# Altium schematic sheet smarttrashcan.SchDoc
size A; SheetNumber: 3; SheetTotal: 3
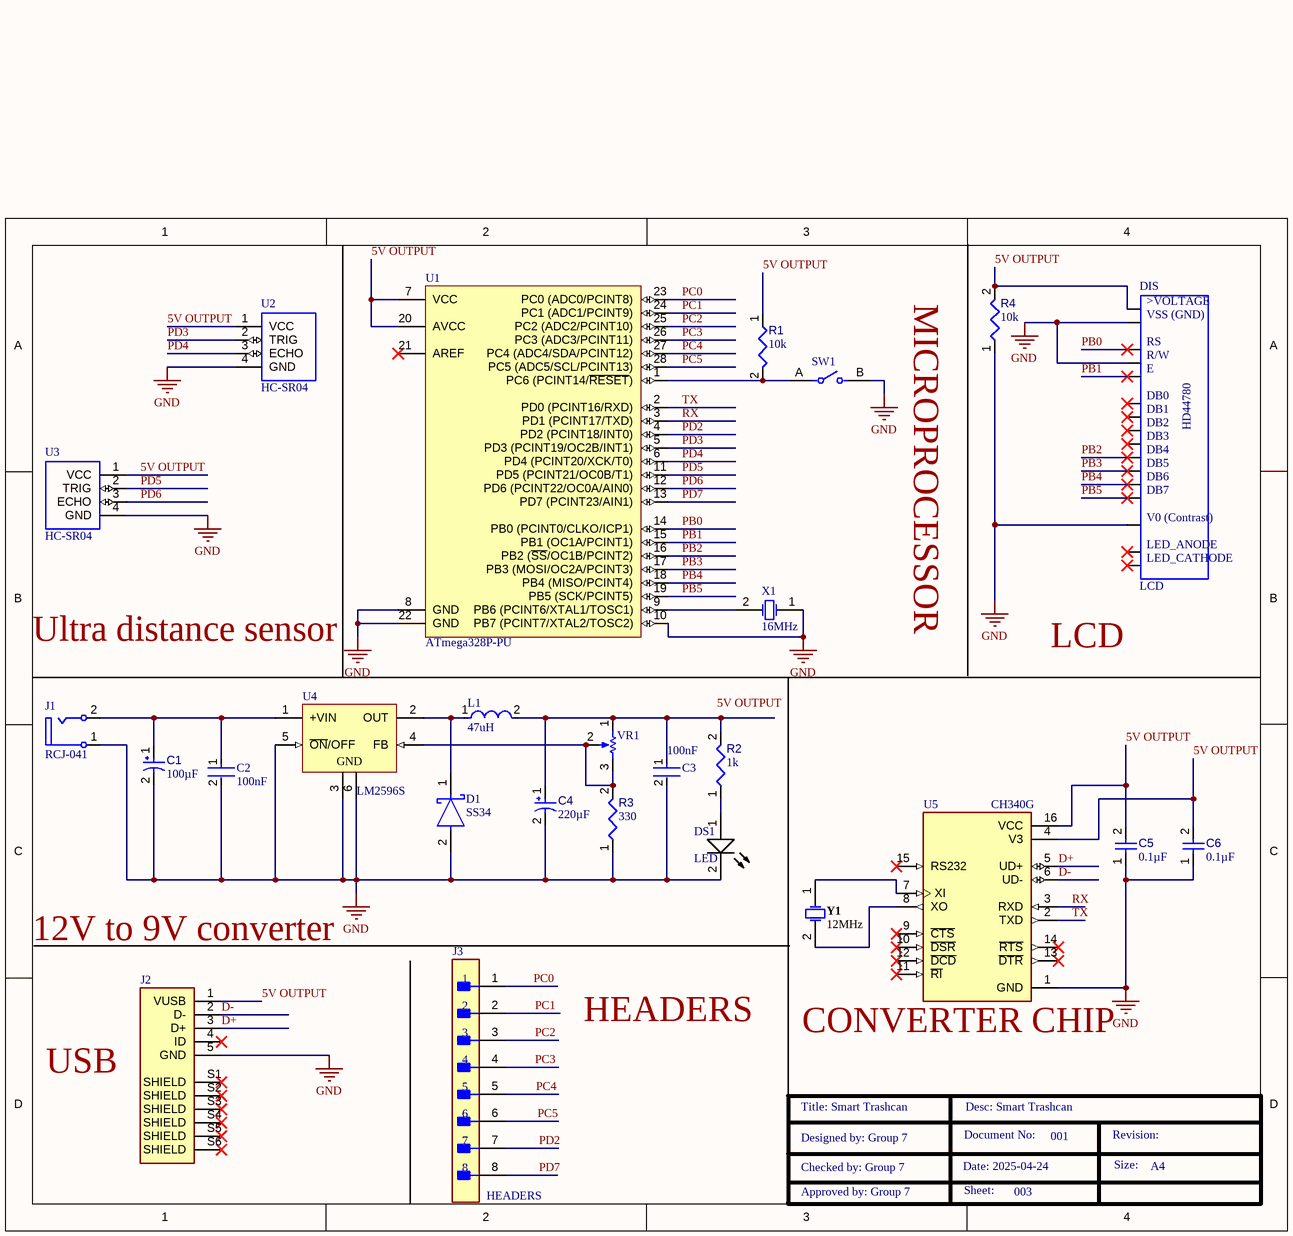
[diagram p0: smarttrashcan.SchDoc]

## Parts
C1  value 100µF  [CAPPR65-500-1600X1000X1700]  (hidden comment: ECA-2AM101)
C2  100nF  [FP-1812-L_4_5_0_3-W_3_2_0-IPC_C]
C3  100nF  [FP-1812-L_4_5_0_3-W_3_2_0-IPC_C]
C4  value 220µF  [CAPMP7344X31-T_V]  (hidden comment: TPSD227K010R0150)
C5  value 0.1µF  [CAPC1005X56X25LL10T15]  (hidden comment: Capacitor 0.1 uF +/- 5% 16 V 0402)
C6  value 0.1µF  [CAPC1005X56X25LL10T15]  (hidden comment: Capacitor 0.1 uF +/- 5% 16 V 0402)
D1  SS34  [FP-95402-MFG]
DIS  LCD  [16026-16X2]
DS1  LED  [EVRL-0402-2_V]
J1  RCJ-041  [CUI-RCJ-041_V]
J2  10118193-0001LF  [AMPHENOL_10118193-0001LF]  (value not drawn)
J3  HEADERS  [FP-22-11-2082-MFG]
L1  47uH  [FP-LB3225-2_5-0_2-IPC_B]
R1  value 10k  [RESC0402(1005)_L]  (hidden comment: 10KR2F)
R2  value 1k  [RESC0402(1005)_L]  (hidden comment: Resistor 330R +/-5 % 0402 63 mW)
R3  value 330  [RESC0402(1005)_L]  (hidden comment: Resistor 330R +/-5 % 0402 63 mW)
R4  value 10k  [RESC0402(1005)_L]  (hidden comment: 10KR2F)
SW1  EVQ11Y04K  [FP-EVQ11Y04K-MFG]  (value not drawn)
U1  ATmega328P-PU  [28P3]
U2  HC-SR04  [XCVR_HC-SR04]
U3  HC-SR04  [XCVR_HC-SR04]
U4  LM2596S  [KTT0005B_L]
U5  CH340G  [SOIC127P600X180-16N]
VR1  3296W-1-103LF  [BOUR-3296W]  (value not drawn)
X1  16MHz  [FOX-FOXSDLF160-20_V]
Y1  12MHz  [FOX-FOXSLF-2_V]

## Nets
GND: C1.2 C2.2 C3.2 C4.2 C5.1 C6.1 D1.2(A) DIS.P$1(VSS) DIS.P$3(CONTRAST) DIS.P$5(R/W) DS1.2(K) J1.1 J2.5(GND) R3.1 R4.1 SW1.B U1.8(GND) U1.10(PB7_(PCINT7/XTAL2/TOSC2)) U1.22(GND) U2.4(GND) U3.4(GND) U4.3(GND) U4.5(~{ON}/OFF) U4.6(GND) U5.1(GND) X1.1(X1)
5V OUTPUT: C5.2 C6.2 DIS.P$2(VDD) J2.1(VUSB) R1.1 R4.2 U1.7(VCC) U1.20(AVCC) U2.1(VCC) U3.1(VCC) U5.4(V3) U5.16(VCC)
D+: J2.3(D+) U5.5(UD+)
D-: J2.2(D-) U5.6(UD-)
PB0: DIS.P$4(RS) U1.14(PB0_(PCINT0/CLKO/ICP1))
PB1: DIS.P$6(E) U1.15(PB1_(OC1A/PCINT1))
PB2: DIS.P$11(DB4) U1.16(PB2_(~{SS}/OC1B/PCINT2))
PB3: DIS.P$12(DB5) U1.17(PB3_(MOSI/OC2A/PCINT3))
PB4: DIS.P$13(DB6) U1.18(PB4_(MISO/PCINT4))
PB5: DIS.P$14(DB7) U1.19(PB5_(SCK/PCINT5))
PC0: J3.1 U1.23(PC0_(ADC0/PCINT8))
PC1: J3.2 U1.24(PC1_(ADC1/PCINT9))
PC2: J3.3 U1.25(PC2_(ADC2/PCINT10))
PC3: J3.4 U1.26(PC3_(ADC3/PCINT11))
PC4: J3.5 U1.27(PC4_(ADC4/SDA/PCINT12))
PC5: J3.6 U1.28(PC5_(ADC5/SCL/PCINT13))
PD2: J3.7 U1.4(PD2_(PCINT18/INT0))
PD3: U1.5(PD3_(PCINT19/OC2B/INT1)) U2.2(TRIG)
PD4: U1.6(PD4_(PCINT20/XCK/T0)) U2.3(ECHO)
PD5: U1.11(PD5_(PCINT21/OC0B/T1)) U3.2(TRIG)
PD6: U1.12(PD6_(PCINT22/OC0A/AIN0)) U3.3(ECHO)
PD7: J3.8 U1.13(PD7_(PCINT23/AIN1))
RX: U1.3(PD1_(PCINT17/TXD)) U5.3(RXD)
TX: U1.2(PD0_(PCINT16/RXD)) U5.2(TXD)
NetC1_1: C1.1 C2.1 J1.2 U4.1(+VIN)
NetC3_1: C3.1 C4.1 L1.2 R2.2 VR1.1(CCW)
NetD1_1: D1.1(C) L1.1 U4.2(OUT)
NetDS1_1: DS1.1(A) R2.1
NetR1_2: R1.2 SW1.A U1.1(PC6_(PCINT14/~{RESET}))
NetR3_2: R3.2 U4.4(FB) VR1.2(S) VR1.3(CW)
NetU1_9: U1.9(PB6_(PCINT6/XTAL1/TOSC1)) X1.2(X2)
NetU5_7: U5.7(XI) Y1.1
NetU5_8: U5.8(XO) Y1.2

Not connected (* = marked no-connect by the designer): DIS P$7(DB0)* P$8(DB1)* P$9(DB2)* P$10(DB3)* P$15(LED_A)* P$16(LED_C)*; J2 4(ID)* S1(SHIELD)* S2(SHIELD)* S3(SHIELD)* S4(SHIELD)* S5(SHIELD)* S6(SHIELD)*; U1 21(AREF)*; U5 9(~{CTS})* 10(~{DSR})* 11(~{RI})* 12(~{DCD})* 13(~{DTR})* 14(~{RTS})* 15(RS232)*

## Notes on the sheet
- MICROPROCESSOR
- (near U1) Ultra distance sensor
- LCD
- (near J2) 12V to 9V converter
- HEADERS
- (near U5) CONVERTER CHIP
- USB
- Title: Smart Trashcan
- Desc: Smart Trashcan
- Designed by: Group 7
- Checked by: Group 7
- Date: 2025-04-24
- Document No:
- 001
- Revision:
- Size:
- A4
- Approved by: Group 7
- Sheet:
- 003
- Labels drawn without touching a wire or pin: 5V OUTPUT
- (in symbol CMP-043-000000-1) >VOLTAGE; VSS (GND); V0 (Contrast); LED_ANODE; LED_CATHODE

## Library data of the parts
C1 = CMP-001-00034-7: Aluminum Electrolytic Capacitor, 100 uF, +/- 20%, 100 V, -40 to 85 degC, 2-Pin THD, RoHS, Bulk; Manufacturer: Panasonic; Ripple Current (AC): 350mA; Voltage Rating: 100V; Max Operating Temperature: 85°C; Package Quantity: 200; Package Description: 2-Pin Through Hole Device, Dia 10 mm, Body Length 16 mm; Package Reference: CAPPR65-500-1600X1000X1700; Pins: 2; Case/Package: Radial; Datasheet URL: https://industrial.panasonic.com/cdbs/www-data/pdf/RDF0000/ABA0000C1047.pdf; Manufacturer URL: http://www.panasonic.com/; Mounting Technology: TH; Packaging: Bulk; Min Operating Temperature: -40°C; Capacitor Type: Electrolytic; Datasheet Version: Mar-16; RoHS Compliant: True; Tolerance: 20%; Diameter: 10mm; Ripple Current: 350mA; Lead Pitch: 5mm
C2 C3 = CMP-1040-01301-2: General Purpose Ceramic Capacitor, 1812, 100nF, 10%, X7R, 15%, 100V; Dissipation Factor: 2.5%; Max Operating Temperature: 125°C; Contact Plating: Tin; Mount: Surface Mount; Case Code (Metric): 4532; Voltage Rating (DC): 100V; Series: -; Case/Package: 1812; Width: 0.126inch; Tolerance: 10%; RoHS Compliant: Yes; Case Code (Imperial): 1812; Voltage: 100V; Dielectric: X7R; Radiation Hardening: No; Construction: Flat; REACH SVHC: No SVHC; Voltage Rating: 100V; Min Operating Temperature: -55°C; Thickness: 0.04inch; Length: 4.5mm; Height: 1.02mm; Packaging: Tape and Reel; Depth: 3.2mm; Package Quantity: 1; Lead Free: Lead Free; Capacitance: 100nF; Number of Pins: 2; Termination: SMD/SMT
C4 = CMP-001-00051-7: Tantalum Capacitor, 220 uF, +/- 10%, 10 V, -55 to 125 degC, 2917 (7343 Metric), RoHS, Tape and Reel; Manufacturer: AVX Corporation; Voltage Rating: 10V; Case/Package: 2917; Datasheet URL: https://datasheet.ciiva.com/8080/1680477-8080379.pdf; Package Description: 2-Pin Surface Mount Device, Body 7.3 x 4.35 mm; Tolerance: 10%; RoHS Compliant: True; Capacitor Type: Tantalum; Manufacturer URL: http://www.avx.com/; Pins: 2; Package Quantity: 1; Max Operating Temperature: 125°C; Mounting Technology: SM; Packaging: TapeandReel; Datasheet Version: 42736; Package Reference: 7343-31; Min Operating Temperature: -55°C
C5 C6 = CMP-001-00001-6: Chip Capacitor, 0.1 uF, +/- 5%, 16 V, 0402 (1005 Metric); Capacitor Type: Ceramic; Voltage Rating: 16V; Max Operating Temperature: 125°C; Min Operating Temperature: -55°C; Case/Package: 0402; Mounting Technology: SM; Pins: 2; Tolerance: 5%; RoHS Compliant: True
D1 = CMP-02539-000012-1: DIODE SCHOTTKY 40V 3A DO214AB; Manufacturer: Vishay; Manufacturer Part Number: SS34-E3/57T; Max Junction Temp: +150°C; Peak Reverse Current: 0.5mA; Max Surge Forward Current: 100A; Standoff Height: 0mm; ComponentLink2Description: Datasheet; Device Class L3: Schottky Diodes; Height: 2.62mm; Max Repetitive Reverse Voltage: 40V; Lead Free: Yes; Package: 95402; Temperature Range High: +150°C; ComponentLink2URL: http://www.vishay.com/docs/88751/ss32.pdf; Temperature: -55°C to +150°C; Footprint Url: http://www.vishay.com/docs/95402/smc.pdf; Automotive: No; Forward Current: 3A; Category: Diode; RoHS: TRUE; Device Class L2: Diodes; Mouser Description: Schottky Diodes & Rectifiers 3.0 Amp 40 Volt; Octopart: https://octopart.com/ss34-e3%2F57t-vishay-39552907; Temperature Range Low: -55°C; Device Class L1: Discrete Semiconductors; Digikey Description: DIODE SCHOTTKY 40V 3A DO214AB
DIS = CMP-043-000000-1: Character LCD Display Module Transflective 5 x 8 Dots STN - Super-Twisted Nematic LED - White Parallel 98.00mm x 60.00mm x 11.60mm; MF: Lumex Opto/Components; Source: SnapEDAsch.SchLib; Pin Count: 16; MP: HD44780; Value: *; Price: None; SnapEDA_Link: https://www.snapeda.com/parts/HD44780/Lumex%20Opto/Components%20Inc./view-part/44140/?ref=snap; Availability: Unavailable; Design Item ID: HD44780; Package: None; Component Type: Standard
DS1 = CMP-007-00000-2: Chip LED, White, 5 V, 10 mA, 30 mW, -40 to 85 degC, 2-Pin SMD (0402), RoHS, Tape and Reel; Manufacturer: Everlight Electronics; Luminous Intensity: 360mcd; Forward Voltage: 2.6V; Viewing Angle: 130degrees; Power: 30mW; Forward Current: 5mA; Package Quantity: 3000; Max Operating Temperature: 85°C; Datasheet Version: Rev. 5, 04/2013; Datasheet URL: http://www.everlight.com/file/ProductFile/16-219A-T2D-AR2T1QY-3T.pdf; Package Reference: 0402; Mounting Technology: SM; Case/Package: 0402; Illumination Colour: White; Manufacturer URL: http://www.everlight.com/; Package Description: 2-Pin Surface Mount Device, Body 1 x 0.5 mm; RoHS Compliant: True; Packaging: TapeandReel; Min Operating Temperature: -40°C
J1 = CMP-002-00009-2: Female RCJ Jack, 2 Position, Height 11.724 mm, Tail Length 4 mm, RoHS, Bulk; Manufacturer: CUI Inc; Connector Type: Audio; Shielding: Unshielded; Housing Material: Plastic; Case/Package: RCJ-041; Min Operating Temperature: -20°C; Contact Material: Brass; Package Reference: RCJ-041; Packaging: Bulk; Package Quantity: 400; Datasheet Version: Rev. B, 02/2012; Manufacturer URL: http://www.cui.com/; Package Description: Female RCJ Jack, 2 Position, Height 11.724 mm, Tail Length 4 mm; RoHS Compliant: True; Datasheet URL: http://www.cui.com/product/resource/rcj-04x.pdf; Max Operating Temperature: 85°C; Gender: Female; Mounting Technology: TH
J2 = CMP-002-00074-1: Right Angle Surface Mount Mount Female USB Connector 100 V ac 1.8A; MF: Amphenol ICC; Source: 10118193-0001LF.SchLib; Component Type: Standard; SnapEDA_Link: https://www.snapeda.com/parts/10118193-0001LF/Amphenol+FCI/view-part/?ref=snap; MP: 10118193-0001LF; Check_prices: https://www.snapeda.com/parts/10118193-0001LF/Amphenol+FCI/view-part/?ref=eda; Design Item ID: 10118193-0001LF; Value: *; Case/Package: None; Pins: 11
J3 = CMP-04776-001014-1: CONN HEADER VERT 8POS 2.54MM; Number of Contacts: 8; Contact Resistance: 10mR; Max Current Rating: 1A; Current Rating: 4A; Gender: Male; Approvals: UL; Connector Type: Male Pin; Voltage Rating: 250V; Contact Type: Male Pin; Color: White; Height: 10.05mm; Fastening Type: Friction; Lead Free: Lead Free; Pitch: 2.54mm; Number of Positions: 8; Termination: Solder; Length: 20.32mm; Series: KK® 6373; Mount: Through Hole; Flammability Rating: UL94 V-0; Number of Circuits: 8; Min Operating Temperature: 0°C; Housing Material: Nylon; Depth: 6.35mm; Orientation: Straight; Packaging: Bulk; Housing Color: White; Contact Material: Brass; Contact Plating: Gold; Radiation Hardening: No; Max Operating Temperature: 75°C; Contact Mating Length: 0.295inch; Number of Rows: 1
L1 = CMP-02424-000224-1: Commercial Inductors, Low DCR Series 47uH 3.3A 145mΩ 20%; Core Material: Metal; Saturation Current: 3A; Self Resonant Frequency: 1MHz; Test Frequency: 100kHz; Shielding: Shielded; DC Resistance (DCR): 145mR; Current Rating: 3.3A; Height: 4mm; Inductance: 47uH; Tolerance: 20%; Lead Free: Lead Free; Radiation Hardening: No; Max Operating Temperature: 125°C; RMS Current (Irms): 3.3A; Contact Plating: Tin; Min Operating Temperature: -55°C; Height - Seated (Max): 0.157inch; Package Quantity: 1; Packaging: Tape and Reel; Depth: 10.3mm; Termination: SMD/SMT; Case/Package: 4040; Military Standard: Not; Max DC Current: 3A; Width: 0.405inch; Length: 0.43inch; Inductance Tolerance: 20%; Mount: Surface Mount; Number of Pins: 2
R1 R4 = CMP-009-00066-2: 10K 0.063W 1% 0402 (1005 Metric)  SMD; Power: 63mW; Case/Package: 0402; Mounting Technology: SMT; Pins: 2; Tolerance: 1%
R2 = CMP-009-00075-2: 1K 0.063W 5% 0402 (1005 Metric)  SMD; Power: 63mW; Pins: 2; Mounting Technology: SMT; Case/Package: 0402; Tolerance: 5%
R3 = CMP-009-00095-2: 330R 0.063W 5% 0402 (1005 Metric)  SMD; Power: 63mW; Tolerance: 5%; Mounting Technology: SMT; Case/Package: 0402; Pins: 2
SW1 = CMP-05618-000106-1: SWITCH TACTILE SPST-NO 0.02A 15V; Operating Force: 1.6N; Actuator Type: Standard; Actuator Length: 0.4mm; Actuator Color: Black; Mechanical Life: 1000000Cycles; Switch Function: Off-Mom; Contact Resistance: 50mR; Switch Travel: 0.25mm; Throw Configuration: SPST; Illumination Type: Non-Illuminated; Package Quantity: 1; Max Operating Temperature: 70°C; Case/Package: Radial; Radiation Hardening: No; Packaging: Tape and Reel; Termination: PC Pin; Orientation: Straight; Min Operating Temperature: -20°C; Lead Free: Lead Free; Electrical Life: 1000000Cycles; RoHS Compliant: Yes; Max Voltage Rating (DC): 15V; Mount: Through Hole; Series: EVQ11; Size: 6mm
U1 = CMP-0095-00013-2: 8-bit AVR Microcontroller, 32KB Flash, 1KB EEPROM, 2KB SRAM, 28-pin PDIP, Industrial Grade (-40°C to 85°C); RevisionNote: DatasheetVersion updated. URLs added.; PackageVersion: revB, Sep-2001; PackageDescription: 28-lead (0.300"/7.62mm Wide) Plastic Dual Inline Package (PDIP); DatasheetVersion: revD, May-2011; ComponentLink1Description: Manufacturer URL; ComponentLink1URL: http://www.atmel.com/; PackageReference: 28P3; ComponentLink2Description: ATmega48A/48PA/88A/88PA/168A/168PA/328/328P Datasheet; ComponentLink3URL: http://www.atmel.com/dyn/resources/prod_documents/8271S.pdf; ComponentLink2URL: http://www.atmel.com/dyn/resources/prod_documents/8271.pdf; ComponentLink3Description: ATmega48A/48PA/88A/88PA/168A/168PA/328/328P Summary
U2 U3 = CMP-041-000000-1: Ultrasonic Sensor Module; Package: None; Design Item ID: HC-SR04; Value: *; MP: HC-SR04; Pin Count: 4; Availability: Unavailable; Price: None; Source: HC-SR04.SchLib; Component Type: Standard
U4 = CMP-2000-06545-1: Simple Switcher(R) Power Converter 150 kHz Step-Down Voltage Regulator, 3 A, 4.5 to 40 V, -40 to 125 degC, 5-Pin TO-263 (KTT), Green (RoHS & no Sb/Br), Tape and Reel; PartNumber: LM2596; Manufacturer: Texas Instruments; Package Version: 4200577-4/G, 01/2013; Primary Input Voltage: 40V; No. of Outputs: 1; No. of Pins: 5; SVHC: NoSVHC(19-Dec-2012); Output Voltage: 37V; Output Current: 3A; Datasheet Version: Rev. C, 04/2013; Package Reference: KTT5; MSL: MSL3-168hours; Number of Outputs: 1; Operating Temperature Min: -40°C; Operating Temperature Range: -40°Cto+125°C; Manufacturer URL: http://www.ti.com/; Package URL: http://www.ti.com/litv/pdf/mpsf007e; Voltage Regulator Case Style: TO-263; Operating Temperature Max: 125°C; Package Description: 5-Pin Plastic Flange Mount, Body 10.16 x 8.925 mm, Pitch 1.7 mm; Datasheet URL: http://www.ti.com/lit/ds/symlink/lm2596.pdf; Mounting Technology: SurfaceMount
U5 = CMP-031-000000-1: USB Interface Integrated Circuit; MF: WCH; Source: CH340G.SchLib; Price: None; Check_prices: https://www.snapeda.com/parts/Ch340G/WCH/view-part/?ref=eda; SnapEDA_Link: https://www.snapeda.com/parts/Ch340G/WCH/view-part/?ref=snap; Design Item ID: CH340G; Availability: Not in stock; Package: None; Pin Count: 16; Value: *; MP: Ch340G; Component Type: Standard
VR1 = CMP-009-00038-2: Square Trimpot(R) Trimming Potentiometer, 10 KOhm, +/- 10%, 0.5 W, -55 to 125 degC, 3-Pin THD, RoHS, Tube; Manufacturer: Bourns; Voltage Rating: 300V; Power: 500mW; Resistance: 10k; Tolerance: 10%; Min Operating Temperature: -55°C; Case/Package: 3296W; Max Operating Temperature: 150°C; Package Reference: 3296W; Mounting Technology: TH; Manufacturer URL: http://www.bourns.com/; Package Quantity: 50; Package Description: 3-Pin Through Hole Device, Body 9.53 x 4.83 mm, Pitch 2.54 mm; Packaging: Rail/Tube; Datasheet URL: http://www.bourns.com/docs/Product-Datasheets/3296.pdf; RoHS Compliant: True; Datasheet Version: May-16
X1 = CMP-003-00024-2: Resistance Weld SMD Crystal, 16 MHz, +/- 30 ppm, 20 pF, -20 to 70 degC, 2-Pin SMD, RoHS, Tape and Reel; Manufacturer: FOX Electronics; Load Capacitance: 20pF; Frequency Tolerance: 30ppm; Tolerance: 50ppm; Resistance: 40Ohm; ESR: 40; Packaging: TapeandReel; Mounting Technology: SM; Package Description: 2-Pin Surface Mount Device, Body 5 x 11.7 mm, Height 4.5 mm; Pins: 2; Datasheet URL: http://foxonline.com/pdfs/hc49sdlf.pdf; Max Operating Temperature: 70°C; Package Reference: FOX-FOXSDLF160-20; Datasheet Version: Mar-15; Package Quantity: 1; Manufacturer URL: http://www.foxonline.com/; Case/Package: FOX-FOXSDLF160-20; Frequency: 16MHz; Min Operating Temperature: -20°C; RoHS Compliant: True
Y1 = CMP-003-00026-2: Resistance Weld Thru-Hole Crystal, 12 MHz, +/-30 ppm, 20 pF, -20 to 70 degC, 2-Pin THD, RoHS, Bulk; Manufacturer: FOX Electronics; ESR: 60; Resistance: 60Ohm; Frequency Tolerance: 30ppm; Load Capacitance: 20pF; Tolerance: 50ppm; Max Operating Temperature: 70°C; Case/Package: FOXSLF-2; Datasheet Version: Mar-15; Mounting Technology: TH; Package Quantity: 100; Package Description: 2-Pin Through Hole Device, Body 11.35 x 4.65 mm, Pitch 4.88 mm; Packaging: Bulk; Package Reference: FOXSLF-2; RoHS Compliant: True; Pins: 2; Frequency: 12MHz; Datasheet URL: http://www.foxonline.com/pdfs/hc49slf.pdf; Manufacturer URL: http://www.foxonline.com/; Min Operating Temperature: -20°C